# Altium schematic sheet Sheet1.SchDoc
size A
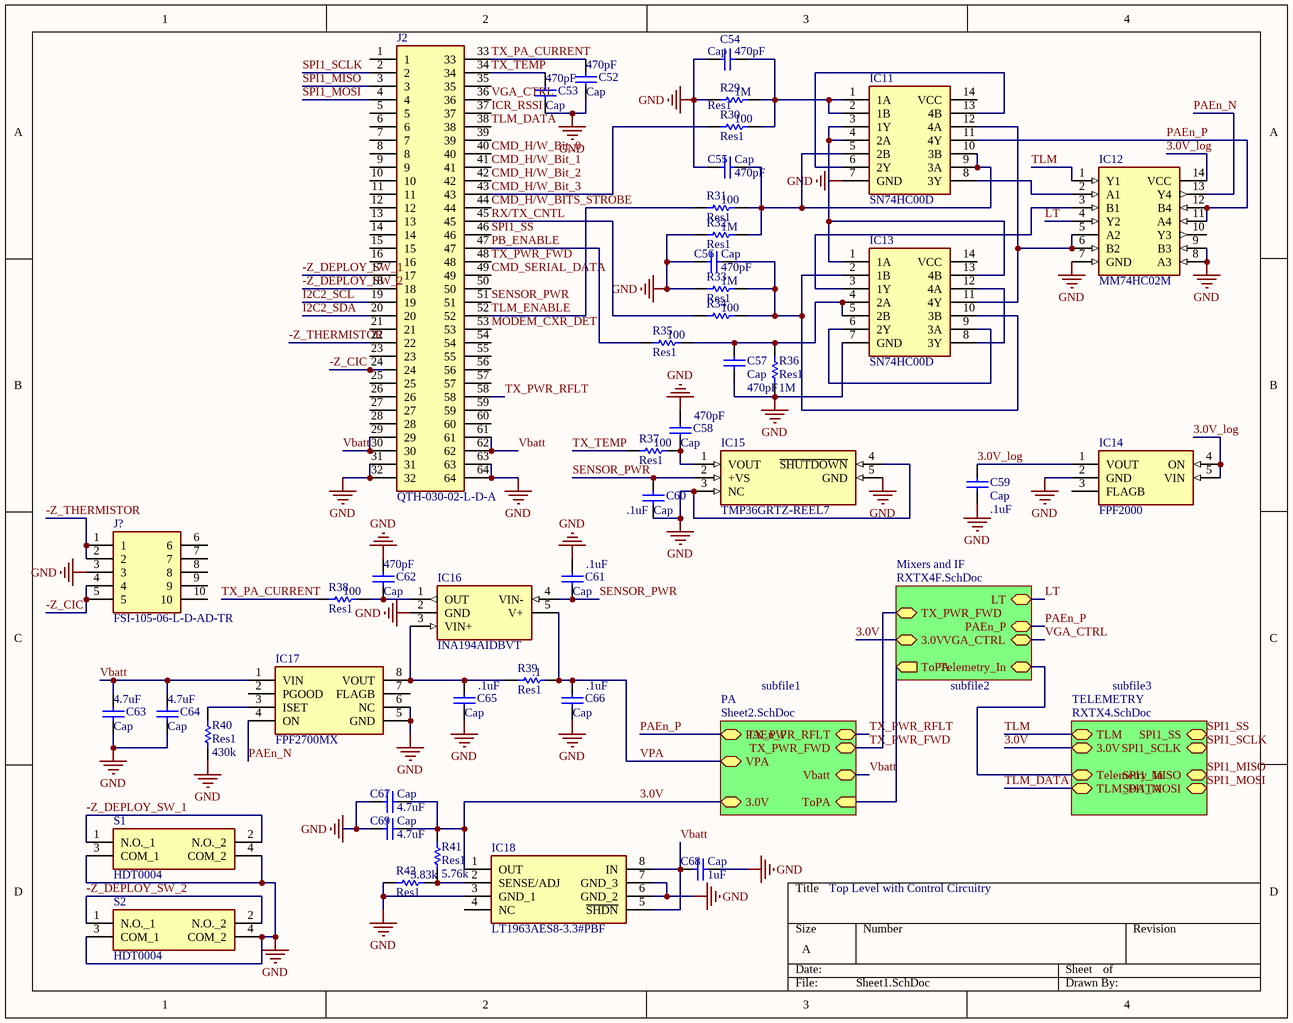
[diagram p0: Sheet1.SchDoc]

## Parts
C52  Cap  value 470pF  [0603]
C53  Cap  value 470pF  [0603]
C54  Cap  value 470pF  [0603]
C55  Cap  value 470pF  [0603]
C56  Cap  value 470pF  [0603]
C57  Cap  value 470pF  [0603]
C58  Cap  value 470pF  [0603]
C59  Cap  value .1uF  [0603]
C60  Cap  value .1uF  [0603]
C61  Cap  value .1uF  [0603]
C62  Cap  value 470pF  [0603]
C63  Cap  value 4.7uF  [0603]
C64  Cap  value 4.7uF  [0603]
C65  Cap  value .1uF  [0603]
C66  Cap  value .1uF  [0603]
C67  Cap  value 4.7uF  [0603]
C68  Cap  value 1uF  [0603]
C69  Cap  value 4.7uF  [0603]
IC11  SN74HC00D  [SOIC127P600X175-14N]
IC12  MM74HC02M  [SOIC127P600X175-14N]
IC13  SN74HC00D  [SOIC127P600X175-14N]
IC14  FPF2000  [SOT65P210X110-5N]
IC15  TMP36GRTZ-REEL7  [SOT95P280X145-5N]
IC16  INA194AIDBVT  [SOT95P280X145-5N]
IC17  FPF2700MX  [SOIC127P600X175-8N]
IC18  LT1963AES8-3.3#PBF  [SOIC127P599X175-8N]
J2  QTH-030-02-L-D-A  [QTH03002LDA]
J?  FSI-105-06-L-D-AD-TR  [FSI10506LDADTR]
R29  Res1  value 1M  [0603]
R30  Res1  value 100  [0603]
R31  Res1  value 100  [0603]
R32  Res1  value 1M  [0603]
R33  Res1  value 1M  [0603]
R34  value 100  [0603]  (hidden comment: Res1)
R35  Res1  value 100  [0603]
R36  Res1  value 1M  [0603]
R37  Res1  value 100  [0603]
R38  Res1  value 100  [0603]
R39  Res1  value .1  [0603]
R40  Res1  value 430k  [0603]
R41  Res1  value 5.76k  [0603]
R42  Res1  value 3.83k  [0603]
S1  HDT0004  [HDT0004]
S2  HDT0004  [HDT0004]

## Sub-sheets
Mixers and IF = RXTX4F.SchDoc: TX_PWR_FWD (bidir), 3.0V (bidir), ToPA (out), LT (bidir), PAEn_P (bidir), VGA_CTRL (bidir), Telemetry_In (bidir)
PA = Sheet2.SchDoc: PAEn_P (bidir), VPA (bidir), 3.0V (bidir), TX_PWR_RFLT (bidir), TX_PWR_FWD (bidir), Vbatt (bidir), ToPA (in)
TELEMETRY = RXTX4.SchDoc: TLM (bidir), 3.0V (bidir), Telemetry_In (bidir), TLM_DATA (bidir), SPI1_SS (bidir), SPI1_SCLK (bidir), SPI1_MISO (bidir), SPI1_MOSI (bidir)

## Nets
GND: C52.2 C53.2 C54.1 C55.1 C56.1 C57.2 C58.1 C59.2 C60.2 C61.1 C62.1 C63.2 C64.2 C65.2 C66.2 C67.1 C68.2 C69.1 IC11.7(GND) IC12.7(GND) IC12.8(A3) IC12.9(B3) IC13.7(GND) IC14.2(GND) IC15.3(NC) IC15.4(~{SHUTDOWN}) IC15.5(GND) IC16.2(GND) IC17.5(GND) IC17.6(NC) IC18.3(GND_1) IC18.6(GND_2) IC18.7(GND_3) J2.31 J2.32 J2.63 J2.64 J?.3 R29.1 R32.1 R33.1 R36.2 R40.2 R42.1 S1.3(COM_1) S1.4(COM_2) S2.3(COM_1) S2.4(COM_2)
3.0V: C67.2 C69.2 IC18.1(OUT) R41.1 ; sheet PA/3.0V, sheet Mixers and IF/3.0V, sheet TELEMETRY/3.0V
3.0V_log: C59.1 IC12.14(VCC) IC14.1(VOUT) IC14.4(ON) IC14.5(VIN)
-Z_CIC: J2.24 J?.4 J?.5
-Z_DEPLOY_SW_1: J2.17 S1.1(N.O._1) S1.2(N.O._2)
-Z_DEPLOY_SW_2: J2.18 S2.1(N.O._1) S2.2(N.O._2)
-Z_THERMISTOR: J2.22 J?.1 J?.2
CMD_H/W_Bit_0: J2.40
CMD_H/W_Bit_1: J2.41
CMD_H/W_Bit_2: J2.42
CMD_H/W_Bit_3: J2.43 R30.1
CMD_H/W_BITS_STROBE: J2.44
CMD_SERIAL_DATA: J2.49
I2C2_SCL: J2.19
I2C2_SDA: J2.20
ICR_RSSI: J2.37
LT: IC12.4(Y2) ; sheet Mixers and IF/LT
MODEM_CXR_DET: J2.53
PAEn_N: IC12.13(Y4) IC17.4(ON)
PAEn_P: IC11.11(4Y) IC12.11(A4) IC12.12(B4) ; sheet PA/PAEn_P, sheet Mixers and IF/PAEn_P
PB_ENABLE: J2.47 R35.1
RX/TX_CNTL: J2.45 R34.1
SENSOR_PWR: C60.1 C61.2 IC15.2(+VS) IC16.4(VIN-) J2.51
SPI1_MISO: J2.3 ; sheet TELEMETRY/SPI1_MISO
SPI1_MOSI: J2.4 ; sheet TELEMETRY/SPI1_MOSI
SPI1_SCLK: J2.2 ; sheet TELEMETRY/SPI1_SCLK
SPI1_SS: J2.46 ; sheet TELEMETRY/SPI1_SS
TLM: IC12.1(Y1) ; sheet TELEMETRY/TLM
TLM_DATA: J2.38 ; sheet TELEMETRY/TLM_DATA
TLM_ENABLE: J2.52 R31.1
TX_PA_CURRENT: C52.1 J2.33 R38.1
TX_PWR_FWD: J2.48 ; sheet PA/TX_PWR_FWD, sheet Mixers and IF/TX_PWR_FWD
TX_PWR_RFLT: J2.58 ; sheet PA/TX_PWR_RFLT
TX_TEMP: C53.1 J2.34 R37.1
Vbatt: C63.1 C64.1 C68.1 IC17.1(VIN) IC18.5(~{SHDN}) IC18.8(IN) J2.29 J2.30 J2.61 J2.62 ; sheet PA/Vbatt
VGA_CTRL: J2.36 ; sheet Mixers and IF/VGA_CTRL
VPA: C66.1 IC16.5(V+) R39.2 ; sheet PA/VPA
NetC54_2: C54.2 IC11.1(1A) IC11.2(1B) R29.2 R30.2
NetC55_2: C55.2 IC11.5(2B) IC11.9(3A) IC11.10(3B) R31.2 R32.2
NetC56_2: C56.2 IC13.2(1B) IC13.10(3B) R33.2 R34.2
NetC57_1: C57.1 IC13.4(2A) IC13.5(2B) R35.2 R36.1
NetC58_2: C58.2 IC15.1(VOUT) R37.2
NetC62_2: C62.2 IC16.1(OUT) R38.2
NetC65_1: C65.1 IC16.3(VIN+) IC17.8(VOUT) R39.1
NetIC11_3: IC11.3(1Y) IC11.4(2A) IC13.1(1A) IC13.13(4B)
NetIC11_6: IC11.6(2Y) IC11.13(4B)
NetIC11_8: IC11.8(3Y) IC12.2(A1)
NetIC11_12: IC11.12(4A) IC12.5(A2) IC12.6(B2) IC13.11(4Y)
NetIC12_3: IC12.3(B1) IC13.3(1Y)
NetIC13_6: IC13.6(2Y) IC13.9(3A)
NetIC13_8: IC13.8(3Y) IC13.12(4A)
NetIC17_3: IC17.3(ISET) R40.1
NetIC18_2: IC18.2(SENSE/ADJ) R41.2 R42.2
(unnamed): sheet PA/ToPA, sheet Mixers and IF/ToPA
(unnamed): sheet Mixers and IF/Telemetry_In, sheet TELEMETRY/Telemetry_In

Not connected (* = marked no-connect by the designer): IC11 14(VCC); IC12 10(Y3); IC13 14(VCC); IC14 3(FLAGB); IC17 2(PGOOD) 7(FLAGB); IC18 4(NC); J2 1 5 6 7 8 9 10 11 12 13 14 15 16 21 23 25 26 27 28 35 39 50 54 55 56 57 59 60; J? 6 7 8 9 10

## Notes on the sheet
- subfile1
- subfile2
- subfile3
- Top Level with Control Circuitry

## Library data of the parts
C52-C69 = Cap: Capacitor; Published: 8-Jun-2000; LatestRevisionDate: 17-Jul-2002; LatestRevisionNote: Re-released for DXP Platform.; PackageReference: RAD-0.3; Publisher: Altium Limited; PackageDescription: Radial Cap, Thru-Hole; 2 Leads; 0.3 in Pin Spacing
IC11 IC13 = SN74HC00D: Integrated Circuit; Manufacturer_Name: Texas Instruments; Datasheet Link: http://www.ti.com/lit/gpn/sn74hc00; Height: 1.75mm; Manufacturer_Part_Number: SN74HC00D; Mouser Part Number: 595-SN74HC00D; Mouser Price/Stock: https://www.mouser.com/Search/Refine.aspx?Keyword=595-SN74HC00D; RS Part Number: 0526234; RS Price/Stock: http://uk.rs-online.com/web/p/products/0526234
IC12 = MM74HC02M: Integrated Circuit; Manufacturer_Name: ON Semiconductor; Datasheet Link: https://www.fairchildsemi.com/datasheets/MM/MM74HC02.pdf; Height: 1.75mm; Manufacturer_Part_Number: MM74HC02M; Mouser Part Number: 512-MM74HC02M; Mouser Price/Stock: https://www.mouser.com/Search/Refine.aspx?Keyword=512-MM74HC02M; RS Part Number: 7613555P; RS Price/Stock: http://uk.rs-online.com/web/p/products/7613555P
IC14 = FPF2000: Integrated Circuit; Manufacturer_Name: ON Semiconductor; Datasheet Link: https://www.onsemi.com/pub/Collateral/FPF2001-D.pdf; Height: 1.1mm; Manufacturer_Part_Number: FPF2000; Mouser Part Number: 512-FPF2000; Mouser Price/Stock: https://www.mouser.com/Search/Refine.aspx?Keyword=512-FPF2000; RS Part Number: 6709942P; RS Price/Stock: http://uk.rs-online.com/web/p/products/6709942P
IC15 = TMP36GRTZ-REEL7: Integrated Circuit; Manufacturer_Name: Analog Devices; Datasheet Link: http://componentsearchengine.com/Datasheets/3/TMP36GRTZ-REEL7.pdf; Height: 1.45mm; Manufacturer_Part_Number: TMP36GRTZ-REEL7; Mouser Part Number: 584-TMP36GRTZ-R7; Mouser Price/Stock: https://www.mouser.com/Search/Refine.aspx?Keyword=584-TMP36GRTZ-R7; RS Part Number: 8099367P; RS Price/Stock: http://uk.rs-online.com/web/p/products/8099367P
IC16 = INA194AIDBVT: Integrated Circuit; Manufacturer_Name: Texas Instruments; Datasheet Link: http://www.ti.com/lit/ds/symlink/ina194.pdf; Height: 1.45mm; Manufacturer_Part_Number: INA194AIDBVT; Mouser Part Number: 595-INA194AIDBVT; Mouser Price/Stock: https://www.mouser.com/Search/Refine.aspx?Keyword=595-INA194AIDBVT; RS Part Number: 5457625P; RS Price/Stock: http://uk.rs-online.com/web/p/products/5457625P
IC17 = FPF2700MX: Integrated Circuit; Manufacturer_Name: ON Semiconductor; Datasheet Link: https://www.onsemi.com/pub/Collateral/FPF2702-D.pdf; Height: 1.75mm; Manufacturer_Part_Number: FPF2700MX; Mouser Part Number: 512-FPF2700MX; Mouser Price/Stock: https://www.mouser.com/Search/Refine.aspx?Keyword=512-FPF2700MX; RS Part Number: 8088966P; RS Price/Stock: http://uk.rs-online.com/web/p/products/8088966P
IC18 = LT1963AES8-3.3#PBF: Integrated Circuit; Manufacturer_Name: Linear Technology; Datasheet Link: http://www.linear.com/docs/3709; Height: 1.752mm; Manufacturer_Part_Number: LT1963AES8-3.3#PBF; Mouser Part Number: 584-1963AES8-3.3PBF; Mouser Price/Stock: https://www.mouser.com/Search/Refine.aspx?Keyword=584-1963AES8-3.3PBF; RS Part Number: 7618550P; RS Price/Stock: http://uk.rs-online.com/web/p/products/7618550P
J2 = QTH-030-02-L-D-A: Connector; Manufacturer_Name: SAMTEC; Datasheet Link: http://suddendocs.samtec.com/prints/qth-xxx-xx-x-d-xxx-mkt.pdf; Height: 7.064mm; Manufacturer_Part_Number: QTH-030-02-L-D-A; Mouser Part Number: 200-QTH03002LDA; Mouser Price/Stock: https://www.mouser.com/Search/Refine.aspx?Keyword=200-QTH03002LDA; RS Part Number: 7678748P; RS Price/Stock: http://uk.rs-online.com/web/p/products/7678748P
J? = FSI-105-06-L-D-AD-TR: Connector; Manufacturer_Name: SAMTEC; Datasheet Link: http://suddendocs.samtec.com/prints/fsi-1xx-xx-xxx-d-x-xx-xx-mkt.pdf; Height: 7.4mm; Manufacturer_Part_Number: FSI-105-06-L-D-AD-TR
R29-R42 = Res1: Resistor; Published: 8-Jun-2000; LatestRevisionDate: 17-Jul-2002; LatestRevisionNote: Re-released for DXP Platform.; PackageReference: AXIAL-0.3; Publisher: Altium Limited; PackageDescription: Axial Device, Thru-Hole; 2 Leads; 0.3 in Pin Spacing
S1 S2 = HDT0004: Switch; Manufacturer_Name: C & K COMPONENTS; Datasheet Link: https://www.ckswitches.com/media/1307/hdt.pdf; Height: 3mm; Manufacturer_Part_Number: HDT0004; Mouser Part Number: 611-HDT0004; Mouser Price/Stock: https://www.mouser.com/Search/Refine.aspx?Keyword=611-HDT0004; RS Part Number: 7931608P; RS Price/Stock: http://uk.rs-online.com/web/p/products/7931608P